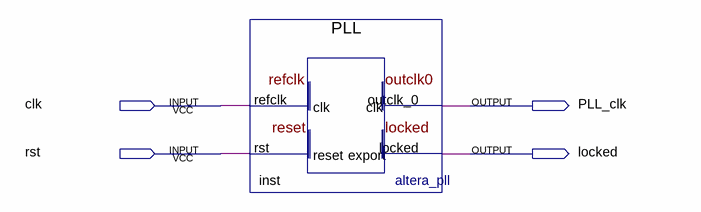
[diagram p0: schematic sheet]
// Quartus schematic PLL_Test.bdf as structural Verilog: 1 symbols, 4 pins
module PLL_Test (
  input  clk,
  input  rst,
  output PLL_clk,
  output locked
);

  PLL inst (.refclk(clk), .rst(rst), .outclk_0(PLL_clk), .locked(locked));
endmodule
